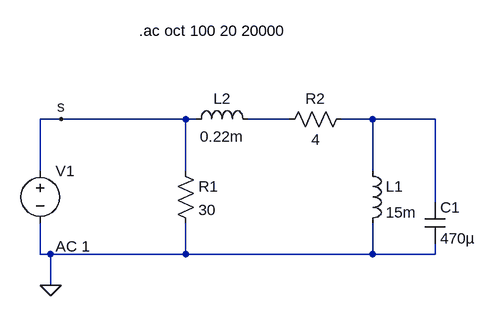
[diagram p0: schematic W100S-4_Ohm.asc]
W100S-4_Ohm.asc, the LTspice schematic file:
Version 4
SHEET 1 880 680
WIRE -208 272 -208 192
WIRE -208 400 -208 352
WIRE -192 400 -208 400
WIRE -192 448 -192 400
WIRE -176 192 -208 192
WIRE 16 192 -176 192
WIRE 16 272 16 192
WIRE 16 400 -192 400
WIRE 16 400 16 352
WIRE 32 192 16 192
WIRE 176 192 112 192
WIRE 304 192 256 192
WIRE 304 272 304 192
WIRE 304 400 16 400
WIRE 304 400 304 352
WIRE 400 192 304 192
WIRE 400 320 400 192
WIRE 400 400 304 400
WIRE 400 400 400 384
FLAG -192 448 0
FLAG -176 192 s
SYMBOL voltage -208 256 R0
WINDOW 123 24 132 Left 0
WINDOW 39 0 0 Left 0
SYMATTR InstName V1
SYMATTR Value ""
SYMATTR Value2 AC 1
SYMBOL ind 288 256 R0
SYMATTR InstName L1
SYMATTR Value 15m
SYMBOL cap 384 320 R0
SYMATTR InstName C1
SYMATTR Value 470µ
SYMATTR SpiceLine Rser=0.8
SYMBOL ind 128 208 M270
WINDOW 0 32 56 VTop 0
WINDOW 3 5 56 VBottom 0
SYMATTR InstName L2
SYMATTR Value 0.22m
SYMBOL res 272 176 R90
WINDOW 0 0 56 VBottom 0
WINDOW 3 32 56 VTop 0
SYMATTR InstName R2
SYMATTR Value 4
SYMBOL res 0 256 R0
SYMATTR InstName R1
SYMATTR Value 30
TEXT -56 56 Left 0 !.ac oct 100 20 20000

The netlist it stands for:
* W100S-4_Ohm.asc
V1 s 0 AC 1
L1 N002 0 15m
C1 N002 0 470µ Rser=0.8
L2 N001 s 0.22m
R2 N002 N001 4
R1 s 0 30
.ac oct 100 20 20000
.backanno
.end